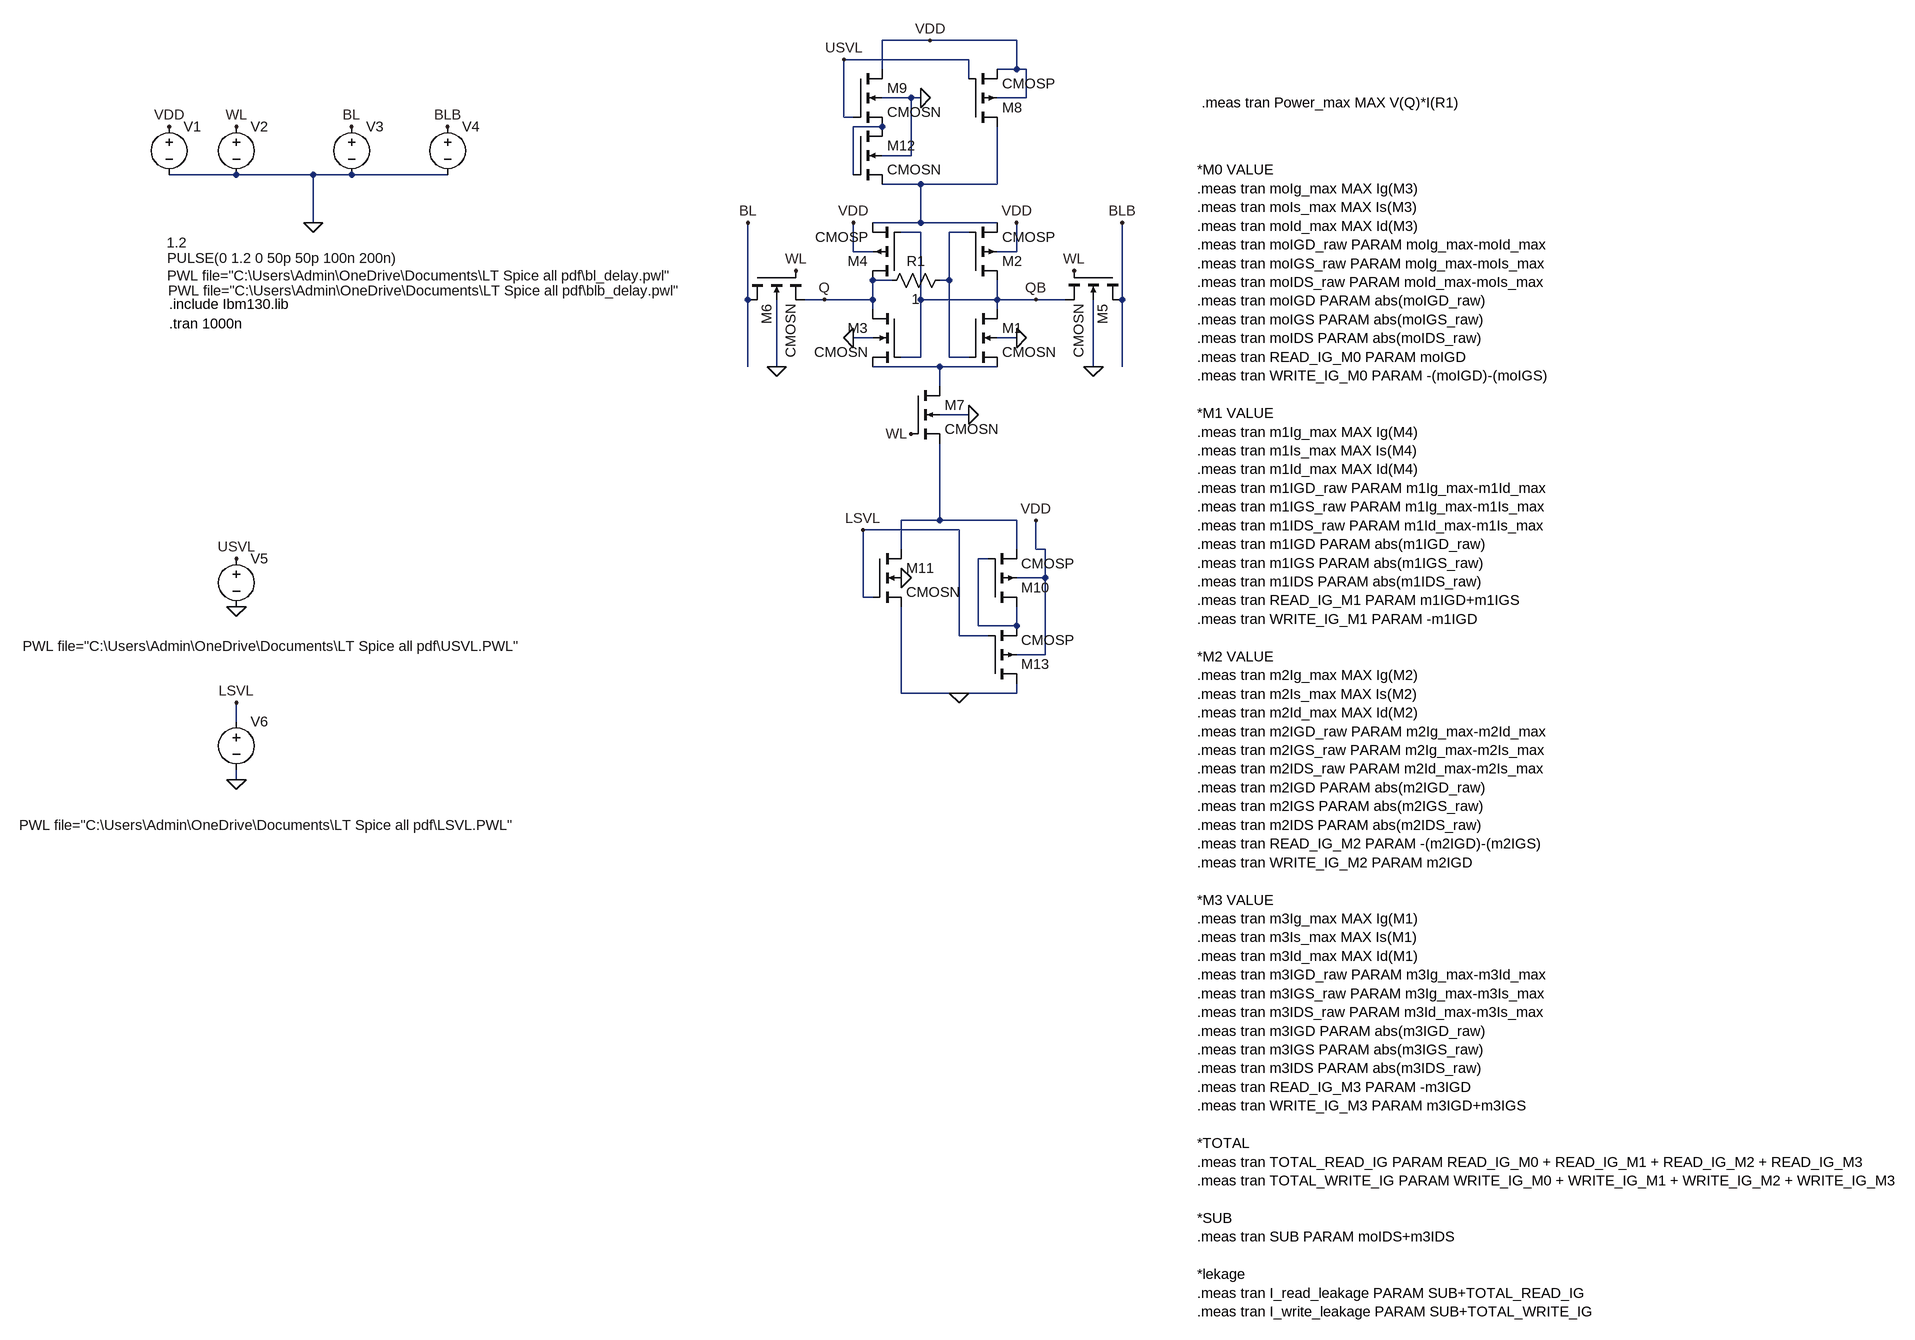
[diagram p0: schematic ISVL7T_CMOS.asc]
ISVL7T_CMOS.asc, the LTspice schematic file:
Version 4
SHEET 1 1608 804
WIRE -304 -1136 -384 -1136
WIRE -160 -1136 -304 -1136
WIRE -240 -1104 -448 -1104
WIRE -384 -1088 -384 -1136
WIRE -160 -1088 -160 -1136
WIRE -160 -1088 -192 -1088
WIRE -144 -1088 -160 -1088
WIRE -240 -1072 -240 -1104
WIRE -336 -1040 -384 -1040
WIRE -320 -1040 -336 -1040
WIRE -144 -1040 -144 -1088
WIRE -144 -1040 -192 -1040
WIRE -448 -1008 -448 -1104
WIRE -432 -1008 -448 -1008
WIRE -384 -992 -432 -992
WIRE -336 -944 -336 -1040
WIRE -336 -944 -384 -944
WIRE -1552 -912 -1664 -912
WIRE -1424 -912 -1552 -912
WIRE -1360 -912 -1424 -912
WIRE -1200 -912 -1360 -912
WIRE -432 -912 -432 -992
WIRE -320 -896 -384 -896
WIRE -192 -896 -192 -992
WIRE -192 -896 -320 -896
WIRE -1424 -832 -1424 -912
WIRE -320 -832 -320 -896
WIRE -320 -832 -400 -832
WIRE -192 -832 -320 -832
WIRE -320 -816 -352 -816
WIRE -240 -816 -272 -816
WIRE -432 -784 -432 -832
WIRE -400 -784 -432 -784
WIRE -160 -784 -160 -832
WIRE -160 -784 -192 -784
WIRE -368 -736 -400 -736
WIRE -272 -736 -272 -816
WIRE -272 -736 -288 -736
WIRE -608 -704 -608 -832
WIRE -480 -704 -512 -704
WIRE -400 -704 -400 -736
WIRE -400 -704 -480 -704
WIRE -320 -704 -320 -816
WIRE -192 -704 -192 -736
WIRE -192 -704 -320 -704
WIRE -128 -704 -192 -704
WIRE -80 -704 -128 -704
WIRE 16 -704 16 -832
WIRE -400 -688 -400 -704
WIRE -192 -688 -192 -704
WIRE -400 -640 -432 -640
WIRE -160 -640 -192 -640
WIRE -320 -608 -320 -704
WIRE -320 -608 -352 -608
WIRE -272 -608 -272 -736
WIRE -240 -608 -272 -608
WIRE -608 -592 -608 -704
WIRE -560 -592 -560 -704
WIRE -288 -592 -400 -592
WIRE -192 -592 -288 -592
WIRE -32 -592 -32 -704
WIRE 16 -592 16 -704
WIRE -288 -560 -288 -592
WIRE -240 -512 -288 -512
WIRE -288 -336 -288 -464
WIRE -288 -336 -352 -336
WIRE -160 -336 -288 -336
WIRE -256 -320 -416 -320
WIRE -352 -288 -352 -336
WIRE -160 -288 -160 -336
WIRE -128 -288 -128 -336
WIRE -112 -288 -128 -288
WIRE -208 -272 -224 -272
WIRE -112 -240 -112 -288
WIRE -112 -240 -160 -240
WIRE -416 -208 -416 -320
WIRE -400 -208 -416 -208
WIRE -224 -160 -224 -272
WIRE -160 -160 -160 -192
WIRE -160 -160 -224 -160
WIRE -256 -144 -256 -320
WIRE -208 -144 -256 -144
WIRE -112 -112 -112 -240
WIRE -112 -112 -160 -112
WIRE -352 -48 -352 -192
WIRE -256 -48 -352 -48
WIRE -160 -48 -160 -64
WIRE -160 -48 -256 -48
WIRE -1552 0 -1552 -32
WIRE -1552 96 -1552 80
FLAG -528 -752 WL
FLAG -64 -752 WL
FLAG -608 -832 BL
FLAG 16 -832 BLB
FLAG -1424 -832 0
FLAG -1664 -992 VDD
FLAG -1552 -992 WL
FLAG -1360 -992 BL
FLAG -1200 -992 BLB
FLAG -480 -704 Q
FLAG -128 -704 QB
FLAG -304 -1136 VDD
FLAG -320 -1040 0
FLAG -448 -1104 USVL
FLAG -1552 -192 0
FLAG -1552 -272 USVL
FLAG -352 -240 0
FLAG -256 -48 0
FLAG -128 -336 VDD
FLAG -416 -320 LSVL
FLAG -160 -640 0
FLAG -432 -640 0
FLAG -560 -592 0
FLAG -32 -592 0
FLAG -432 -832 VDD
FLAG -160 -832 VDD
FLAG -336 -480 WL
FLAG -1552 96 0
FLAG -1552 -32 LSVL
FLAG -240 -512 0
SYMBOL CMOSN -240 -688 R0
SYMATTR InstName M1
SYMATTR Value2 l=130nm w=360nm
SYMBOL CMOSP -240 -736 M180
SYMATTR InstName M2
SYMATTR Value2 l=130nm w=260nm
SYMBOL CMOSN -352 -688 M0
SYMATTR InstName M3
SYMATTR Value2 l=130nm w=360nm
SYMBOL CMOSP -352 -736 R180
SYMATTR InstName M4
SYMATTR Value2 l=130nm w=260nm
SYMBOL CMOSN 16 -752 R90
SYMATTR InstName M5
SYMATTR Value2 l=130nm w=260nm
SYMBOL CMOSN -608 -752 M90
SYMATTR InstName M6
SYMATTR Value2 l=130nm w=260nm
SYMBOL voltage -1664 -1008 R0
WINDOW 3 -4 209 Left 2
WINDOW 123 0 0 Left 0
WINDOW 39 0 0 Left 0
SYMATTR Value 1.2
SYMATTR InstName V1
SYMBOL voltage -1552 -1008 R0
WINDOW 3 -115 235 Left 2
WINDOW 123 0 0 Left 0
WINDOW 39 0 0 Left 0
SYMATTR Value PULSE(0 1.2 0 50p 50p 100n 200n)
SYMATTR InstName V2
SYMBOL voltage -1360 -1008 R0
WINDOW 3 -307 264 Left 2
WINDOW 123 0 0 Left 0
WINDOW 39 0 0 Left 0
SYMATTR Value PWL file="C:\Users\Admin\OneDrive\Documents\LT Spice all pdf\bl_delay.pwl"
SYMATTR InstName V3
SYMBOL voltage -1200 -1008 R0
WINDOW 3 -466 289 Left 2
WINDOW 123 0 0 Left 0
WINDOW 39 0 0 Left 0
SYMATTR Value PWL file="C:\Users\Admin\OneDrive\Documents\LT Spice all pdf\blb_delay.pwl"
SYMATTR InstName V4
SYMBOL CMOSN -336 -560 R0
SYMATTR InstName M7
SYMATTR Value2 l=130nm w=260nm
SYMBOL res -272 -752 R90
WINDOW 0 0 56 VBottom 2
WINDOW 3 32 56 VTop 2
SYMATTR InstName R1
SYMATTR Value 1
SYMBOL CMOSP -240 -992 M180
SYMATTR InstName M8
SYMATTR Value2 l=130nm w=240nm
SYMBOL CMOSN -432 -1088 R0
SYMATTR InstName M9
SYMATTR Value2 l=130nm w=20nm
SYMBOL voltage -1552 -288 R0
WINDOW 3 -356 162 Left 2
WINDOW 123 0 0 Left 0
WINDOW 39 0 0 Left 0
SYMATTR Value PWL file="C:\Users\Admin\OneDrive\Documents\LT Spice all pdf\USVL.PWL"
SYMATTR InstName V5
SYMBOL CMOSP -208 -192 M180
SYMATTR InstName M10
SYMATTR Value2 l=130nm w=260nm
SYMBOL CMOSN -400 -288 R0
SYMATTR InstName M11
SYMATTR Value2 l=130nm w=20nm
SYMBOL voltage -1552 -16 R0
WINDOW 3 -362 188 Left 2
WINDOW 123 0 0 Left 0
WINDOW 39 0 0 Left 0
SYMATTR Value PWL file="C:\Users\Admin\OneDrive\Documents\LT Spice all pdf\LSVL.PWL"
SYMATTR InstName V6
SYMBOL CMOSN -432 -992 R0
SYMATTR InstName M12
SYMATTR Value2 l=130nm w=20nm
SYMBOL CMOSP -208 -64 M180
SYMATTR InstName M13
SYMATTR Value2 l=130nm w=260nm
TEXT -1664 -696 Left 2 !.include Ibm130.lib
TEXT -1664 -664 Left 2 !.tran 1000n
TEXT 384 -920 Left 2 !*M0 VALUE\n.meas tran moIg_max MAX Ig(M3)\n.meas tran moIs_max MAX Is(M3)\n.meas tran moId_max MAX Id(M3)\n.meas tran moIGD_raw PARAM moIg_max-moId_max\n.meas tran moIGS_raw PARAM moIg_max-moIs_max\n.meas tran moIDS_raw PARAM moId_max-moIs_max\n.meas tran moIGD PARAM abs(moIGD_raw)\n.meas tran moIGS PARAM abs(moIGS_raw)\n.meas tran moIDS PARAM abs(moIDS_raw)\n.meas tran READ_IG_M0 PARAM moIGD\n.meas tran WRITE_IG_M0 PARAM -(moIGD)-(moIGS)\n \n*M1 VALUE\n.meas tran m1Ig_max MAX Ig(M4)\n.meas tran m1Is_max MAX Is(M4)\n.meas tran m1Id_max MAX Id(M4)\n.meas tran m1IGD_raw PARAM m1Ig_max-m1Id_max\n.meas tran m1IGS_raw PARAM m1Ig_max-m1Is_max\n.meas tran m1IDS_raw PARAM m1Id_max-m1Is_max\n.meas tran m1IGD PARAM abs(m1IGD_raw)\n.meas tran m1IGS PARAM abs(m1IGS_raw)\n.meas tran m1IDS PARAM abs(m1IDS_raw)\n.meas tran READ_IG_M1 PARAM m1IGD+m1IGS\n.meas tran WRITE_IG_M1 PARAM -m1IGD\n \n*M2 VALUE\n.meas tran m2Ig_max MAX Ig(M2)\n.meas tran m2Is_max MAX Is(M2)\n.meas tran m2Id_max MAX Id(M2)\n.meas tran m2IGD_raw PARAM m2Ig_max-m2Id_max\n.meas tran m2IGS_raw PARAM m2Ig_max-m2Is_max\n.meas tran m2IDS_raw PARAM m2Id_max-m2Is_max\n.meas tran m2IGD PARAM abs(m2IGD_raw)\n.meas tran m2IGS PARAM abs(m2IGS_raw)\n.meas tran m2IDS PARAM abs(m2IDS_raw)\n.meas tran READ_IG_M2 PARAM -(m2IGD)-(m2IGS)\n.meas tran WRITE_IG_M2 PARAM m2IGD\n \n*M3 VALUE\n.meas tran m3Ig_max MAX Ig(M1)\n.meas tran m3Is_max MAX Is(M1)\n.meas tran m3Id_max MAX Id(M1)\n.meas tran m3IGD_raw PARAM m3Ig_max-m3Id_max\n.meas tran m3IGS_raw PARAM m3Ig_max-m3Is_max\n.meas tran m3IDS_raw PARAM m3Id_max-m3Is_max\n.meas tran m3IGD PARAM abs(m3IGD_raw)\n.meas tran m3IGS PARAM abs(m3IGS_raw)\n.meas tran m3IDS PARAM abs(m3IDS_raw)\n.meas tran READ_IG_M3 PARAM -m3IGD\n.meas tran WRITE_IG_M3 PARAM m3IGD+m3IGS\n \n*TOTAL \n.meas tran TOTAL_READ_IG PARAM READ_IG_M0 + READ_IG_M1 + READ_IG_M2 + READ_IG_M3\n.meas tran TOTAL_WRITE_IG PARAM WRITE_IG_M0 + WRITE_IG_M1 + WRITE_IG_M2 + WRITE_IG_M3\n \n*SUB\n.meas tran SUB PARAM moIDS+m3IDS\n \n*lekage\n.meas tran I_read_leakage PARAM SUB+TOTAL_READ_IG\n.meas tran I_write_leakage PARAM SUB+TOTAL_WRITE_IG
TEXT 392 -1032 Left 2 !.meas tran Power_max MAX V(Q)*I(R1)

The netlist it stands for:
* ISVL7T_CMOS.asc
M1 QB N003 N004 0 CMOSN l=130nm w=360nm
M2 QB N003 N002 VDD CMOSP l=130nm w=260nm
M3 Q QB N004 0 CMOSN l=130nm w=360nm
M4 Q QB N002 VDD CMOSP l=130nm w=260nm
M5 BLB WL QB 0 CMOSN l=130nm w=260nm
M6 BL WL Q 0 CMOSN l=130nm w=260nm
V1 VDD 0 1.2
V2 WL 0 PULSE(0 1.2 0 50p 50p 100n 200n)
V3 BL 0 PWL file="C:\Users\Admin\OneDrive\Documents\LT Spice all pdf\bl_delay.pwl"
V4 BLB 0 PWL file="C:\Users\Admin\OneDrive\Documents\LT Spice all pdf\blb_delay.pwl"
M7 N004 WL N005 0 CMOSN l=130nm w=260nm
R1 N003 Q 1
M8 N002 USVL VDD VDD CMOSP l=130nm w=240nm
M9 VDD USVL N001 0 CMOSN l=130nm w=20nm
V5 USVL 0 PWL file="C:\Users\Admin\OneDrive\Documents\LT Spice all pdf\USVL.PWL"
M10 N006 N006 N005 VDD CMOSP l=130nm w=260nm
M11 N005 LSVL 0 0 CMOSN l=130nm w=20nm
V6 LSVL 0 PWL file="C:\Users\Admin\OneDrive\Documents\LT Spice all pdf\LSVL.PWL"
M12 N001 N001 N002 0 CMOSN l=130nm w=20nm
M13 0 LSVL N006 VDD CMOSP l=130nm w=260nm
.model NMOS NMOS
.model PMOS PMOS
.lib standard.mos
.include Ibm130.lib
.tran 1000n
*M0 VALUE
.meas tran moIg_max MAX Ig(M3)
.meas tran moIs_max MAX Is(M3)
.meas tran moId_max MAX Id(M3)
.meas tran moIGD_raw PARAM moIg_max-moId_max
.meas tran moIGS_raw PARAM moIg_max-moIs_max
.meas tran moIDS_raw PARAM moId_max-moIs_max
.meas tran moIGD PARAM abs(moIGD_raw)
.meas tran moIGS PARAM abs(moIGS_raw)
.meas tran moIDS PARAM abs(moIDS_raw)
.meas tran READ_IG_M0 PARAM moIGD
.meas tran WRITE_IG_M0 PARAM -(moIGD)-(moIGS)
*M1 VALUE
.meas tran m1Ig_max MAX Ig(M4)
.meas tran m1Is_max MAX Is(M4)
.meas tran m1Id_max MAX Id(M4)
.meas tran m1IGD_raw PARAM m1Ig_max-m1Id_max
.meas tran m1IGS_raw PARAM m1Ig_max-m1Is_max
.meas tran m1IDS_raw PARAM m1Id_max-m1Is_max
.meas tran m1IGD PARAM abs(m1IGD_raw)
.meas tran m1IGS PARAM abs(m1IGS_raw)
.meas tran m1IDS PARAM abs(m1IDS_raw)
.meas tran READ_IG_M1 PARAM m1IGD+m1IGS
.meas tran WRITE_IG_M1 PARAM -m1IGD
*M2 VALUE
.meas tran m2Ig_max MAX Ig(M2)
.meas tran m2Is_max MAX Is(M2)
.meas tran m2Id_max MAX Id(M2)
.meas tran m2IGD_raw PARAM m2Ig_max-m2Id_max
.meas tran m2IGS_raw PARAM m2Ig_max-m2Is_max
.meas tran m2IDS_raw PARAM m2Id_max-m2Is_max
.meas tran m2IGD PARAM abs(m2IGD_raw)
.meas tran m2IGS PARAM abs(m2IGS_raw)
.meas tran m2IDS PARAM abs(m2IDS_raw)
.meas tran READ_IG_M2 PARAM -(m2IGD)-(m2IGS)
.meas tran WRITE_IG_M2 PARAM m2IGD
*M3 VALUE
.meas tran m3Ig_max MAX Ig(M1)
.meas tran m3Is_max MAX Is(M1)
.meas tran m3Id_max MAX Id(M1)
.meas tran m3IGD_raw PARAM m3Ig_max-m3Id_max
.meas tran m3IGS_raw PARAM m3Ig_max-m3Is_max
.meas tran m3IDS_raw PARAM m3Id_max-m3Is_max
.meas tran m3IGD PARAM abs(m3IGD_raw)
.meas tran m3IGS PARAM abs(m3IGS_raw)
.meas tran m3IDS PARAM abs(m3IDS_raw)
.meas tran READ_IG_M3 PARAM -m3IGD
.meas tran WRITE_IG_M3 PARAM m3IGD+m3IGS
*TOTAL
.meas tran TOTAL_READ_IG PARAM READ_IG_M0 + READ_IG_M1 + READ_IG_M2 + READ_IG_M3
.meas tran TOTAL_WRITE_IG PARAM WRITE_IG_M0 + WRITE_IG_M1 + WRITE_IG_M2 + WRITE_IG_M3
*SUB
.meas tran SUB PARAM moIDS+m3IDS
*lekage
.meas tran I_read_leakage PARAM SUB+TOTAL_READ_IG
.meas tran I_write_leakage PARAM SUB+TOTAL_WRITE_IG
.meas tran Power_max MAX V(Q)*I(R1)
.backanno
.end